# EAGLE design lna (EAGLE 6.5.0)
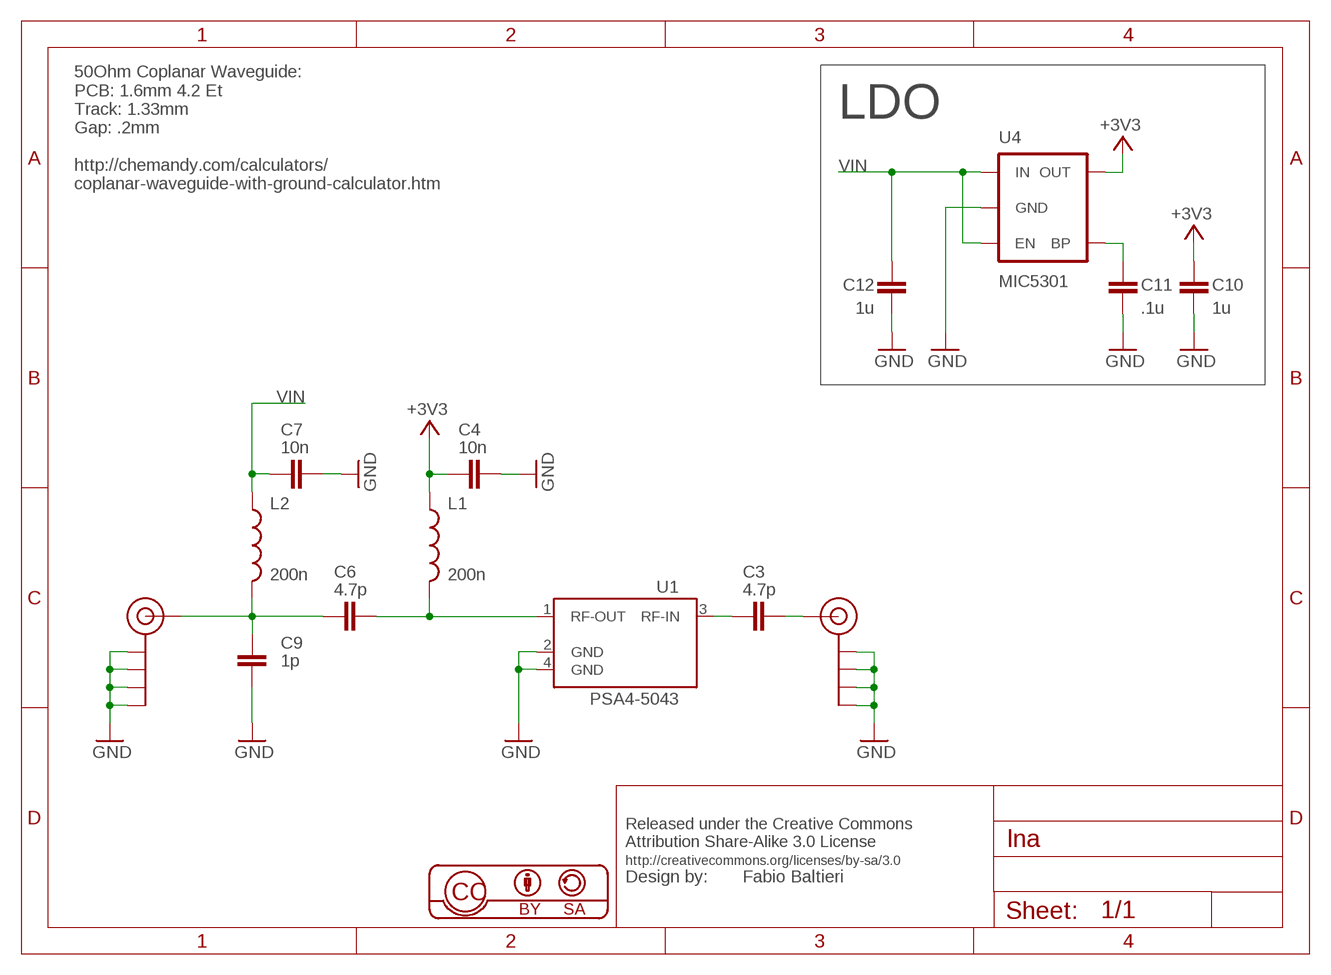
[diagram p0: schematic, sheet 1]

## Parts
C3  4.7p  C-EUC0603  [C0603]
C4  10n  C-EUC0603  [C0603]
C6  4.7p  C-EUC0603  [C0603]
C7  10n  C-EUC0603  [C0603]
C9  1p  C-EUC0603  [C0603]
C10  1u  C-EUC0603  [C0603]
C11  .1u  C-EUC0603  [C0603]
C12  1u  C-EUC0603  [C0603]
J$1  SMA_EDGE  [SMA-EDGE]
J$2  SMA_EDGE  [SMA-EDGE]
L1  200n  INDUCTOR0603  [0603]
L2  200n  INDUCTOR0603  [0603]
U1  PSA4-5043  [SOT343R]
U4  MIC5301  V_REG_LDOSMD  [SOT23-5]

## Nets
+3V3: C4.1 C10.1 L1.1 U4.5(OUT)
GND: C4.2 C7.2 C9.2 C10.2 C11.2 C12.2 J$1.GND@0(GND) J$1.GND@1(GND) J$1.GND@2(GND) J$1.GND@3(GND) J$2.GND@0(GND) J$2.GND@1(GND) J$2.GND@2(GND) J$2.GND@3(GND) U1.2(GND) U1.4(GND) U4.2(GND)
N$1: C3.2 J$2.SIG(SIGNAL)
N$2: C3.1 U1.3(RF-IN)
N$3: C6.2 L1.2 U1.1(RF-OUT)
N$8: C11.1 U4.4(BP)
N$9: C6.1 C9.1 J$1.SIG(SIGNAL) L2.2
VIN: C7.1 C12.1 L2.1 U4.1(IN) U4.3(EN)

## Notes on the sheet
- LDO
- 50Ohm Coplanar Waveguide:
  PCB: 1.6mm 4.2 Et
  Track: 1.33mm
  Gap: .2mm
  
  http://chemandy.com/calculators/
  coplanar-waveguide-with-ground-calculator.htm

## Library data of the parts
C3 C4 C6 C7 C9-C12 = rcl:C-EU: CAPACITOR, European symbol
J$1 J$2 = SparkFun-Connectors:SMA_EDGE: SMA Antenna Connector End launch SMA connector. The paste layer has been removed so that the connector can be hand soldered onto the board after reflow.
L1 L2 = SparkFun-Passives:INDUCTOR: Inductors Basic Inductor/Choke - 0603 and 1206. Footprints are not proven and vary greatly between part numbers. SRN6045- 33uH, 20% 1.4A SDR0403-560KL - 56uH, 10%, 500mA RMS/740mA peak
U1 = balto:PSA4-5043: Ultra Low Noise MMIC Amplifier
U4 = SparkFun-PowerIC:V_REG_LDO: Voltage Regulator LDO Standard 150mA LDO voltage regulator in SOT-23 layout. Micrel part MIC5205. BP (by-pass) pin is used to lower output noise with 470pF cap.

## Board
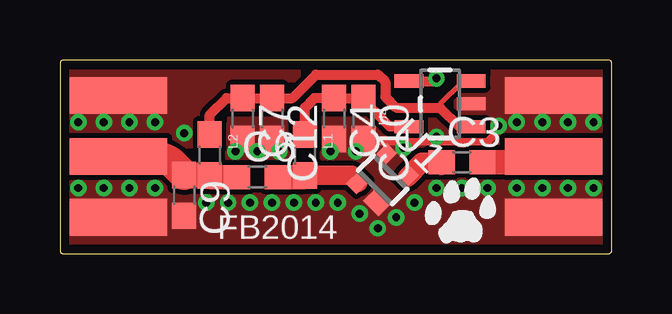
[diagram p1: board, top side]
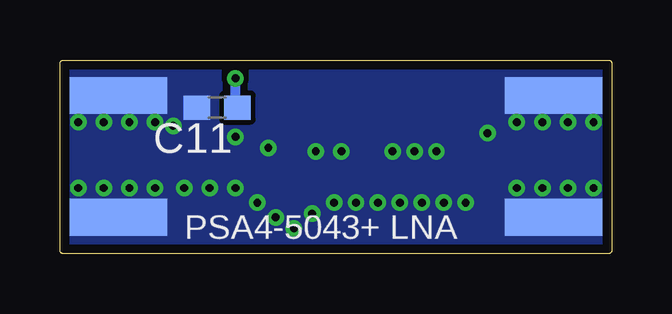
[diagram p2: board, bottom side, seen from below]

Size 23.01 x 8.08 mm. Coordinates in mm from the lower left corner, seen from the top.
Outline: 0,7.92 0,0.15 arc90 0.15,0 22.86,0 arc90 23.01,0.15 23.01,7.92 arc90 22.86,8.08 0.15,8.08 arc90 0,7.92
Copper layers (1*16): Top 0.035mm / dielectric 1.5mm / Bottom 0.035mm
Design rules "balto": minimum track width 6mil, minimum drill 13mil, track to track 6mil, track to pad 6mil, pad to pad 6mil, via to via 6mil, smd to smd 6mil, copper to edge 15mil, drill to drill 6mil, minimum pad ring 7mil, minimum via ring 7mil, stop-mask expansion 2mil, vias tented up to drill 20mil, thermal gap 8mil

### Footprints (pad centres in the part's own frame; a part is rotated, then mirrored left to right if it is on the bottom)
C0603 = smd 1.1 x 1: 1 -0.85,0; 2 0.85,0
SMA-EDGE = smd 1.524 x 4.064: GND@0 0,0; GND@1 5.08,0; SIG 2.54,0 | smd 1.524 x 4.064 bottom: GND@2 0,0; GND@3 5.08,0
0603 = smd 1.1 x 1: 1 -0.85,0; 2 0.85,0
SOT343R = smd 0.6 x 0.8: 1 -0.65,-0.8; 3 0.65,0.8; 4 -0.65,0.8 | smd 0.9 x 0.8: 2 0.5,-0.8
SOT23-5 = smd 0.55 x 1.2: 1 -0.95,-1.3; 2 0,-1.3; 3 0.95,-1.3; 4 0.95,1.3; 5 -0.95,1.3

### Placement (x,y rotation side)
C3  16.76,3.81 0 top
C4  11.43,5.64 270 top
C6  8.23,3.2 0 top
C7  7.62,5.64 270 top
C9  5.18,2.44 270 top
C10  12.65,5.64 270 top
C11  16.46,6.1 180 bottom
C12  8.84,5.64 270 top
J$1  2.44,1.52 90 top
J$2  20.57,1.52 90 top
L1  10.21,4.11 270 top
L2  6.25,4.11 270 top
U1  13.46,3.09 315 top
U4  15.85,6.25 90 top
U$1  [CAT-L]  16.76,1.37 0 top

### Tracks (layer width: path | path; a pad name or v marks a point on that pad's centre or on a via)
+3V3
  Top 0.406: L1.1 10.21,6.1 10.6,6.49 C4.1 C10.1 12.65,6.4 13.75,5.3 U4.5
GND  (via drill 0.33)
  Top 0.305: 13.41,4.67 17.83,4.67 18.14,4.98
  other vias: 7.32,4.27 8.23,4.27 9.14,4.27 11.28,4.27 12.34,4.27 5.18,5.03 6.1,2.13 7.01,2.13 7.92,2.13 8.84,2.13 9.75,2.13 10.67,2.13 11.58,2.13 14.78,2.13 14.33,4.42 15.7,2.74 16.76,2.74 17.83,2.74 19.05,2.74 3.96,2.74 2.9,2.74 1.83,2.74 0.76,2.74 0.76,5.49 1.83,5.49 2.9,5.49 3.96,5.49 20.12,2.74 21.18,2.74 22.25,2.74 22.25,5.49 21.18,5.49 20.12,5.49 19.05,5.49 15.7,4.88 12.5,1.68 14.02,1.52 18.29,5.33 13.26,1.07
  pour Top (isolate 0.203, no thermals): -0.3,-0.3 24.54,-0.3 24.54,8.53 -0.3,8.53
  pour Bottom (isolate 0.203, no thermals): 24.69,9.3 -0.76,9.3 -0.76,-0.76 24.69,-0.76
N$1
  Top 1.016: C3.2 20.32,3.81 J$2.SIG
N$2
  Top 0.813: C3.1 15.09,3.81 U1.3
  Top 1.016: C3.1
N$3
  Top 0.813: L1.2 12.15,3.27 U1.1
  Top 1.016: C6.2 10.15,3.2 L1.2
N$8  (via drill 0.33)
  Top 0.406: U4.4 15.58,7.2 v15.7,7.32
  Bottom 0.406: C11.1 15.7,6.18 v15.7,7.32
N$9
  Top 1.016: C9.1 5.21,3.27 L2.2 6.31,3.2 C6.1
  Top 1.27: J$1.SIG 3.88,4.06 arc-45 4.78,3.69 C9.1
VIN
  Top 0.203: 15.85,6.1 15.85,6.25 16.8,7.2 U4.3
  Top 0.406: L2.1 6.25,5.79 6.95,6.49 C7.1 C12.1 9.69,6.49 10.67,7.47 13.26,7.47 13.56,7.16 13.56,6.55 14.02,6.1 15.85,6.1 16.65,5.3 U4.1

### Text on the board
_tsilk: FB2014
_bsilk: PSA4-5043+ LNA